# EAGLE design PIC4550 (EAGLE 5.08)
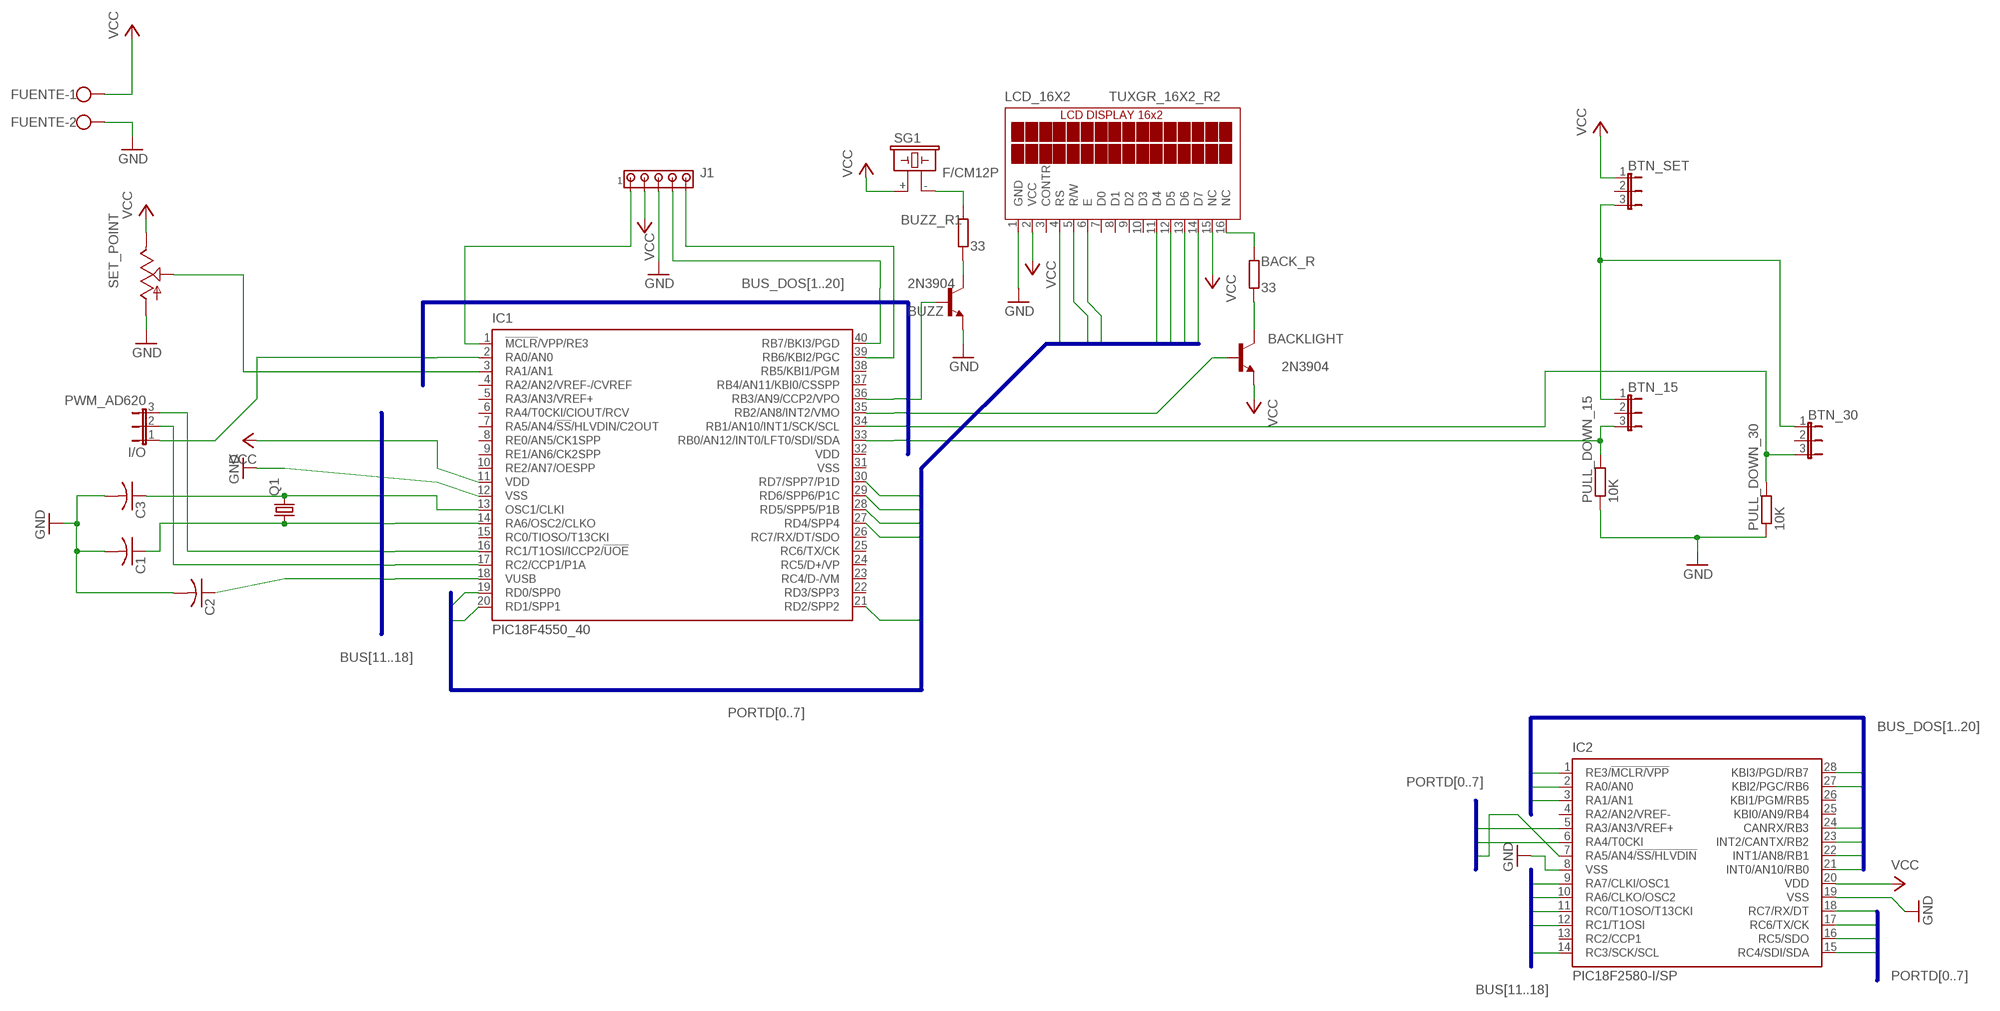
[diagram p0: schematic, sheet 1]

## Parts
BACK_R  33  R-EU_0207/12  [0207/12]
BACKLIGHT  2N3904  [TO92]
BTN_15  JP2E  [JP2]
BTN_30  JP2E  [JP2]
BTN_SET  JP2E  [JP2]
BUZZ  2N3904  [TO92]
BUZZ_R1  33  R-EU_0207/12  [0207/12]
C1  C-US025-024X044  [C025-024X044]
C2  C-US025-024X044  [C025-024X044]
C3  C-US025-024X044  [C025-024X044]
FUENTE  W237-02P  [W237-132]
I/O  PWM_AD620  JP2E  [JP2]
IC1  PIC18F4550_40  [DIL40]
IC2  PIC18F2580-I/SP  [DIL28-3]
J1  MTA05-100  [10X05MTA]
LCD_16X2  TUXGR_16X2_R2  [TUXGR_16X2_R2]
PULL_DOWN_15  10K  R-EU_0207/12  [0207/12]
PULL_DOWN_30  10K  R-EU_0207/12  [0207/12]
Q1  CRYSTALHC49S  [HC49/S]
SET_POINT  TRIM_US-CIP20C-4MM  [CIP20C-4MM]
SG1  F/CM12P  [F/CM12P]

## Nets
BUS13: C3.1 IC1.13(OSC1/CLKI) IC2.9(RA7/CLKI/OSC1) Q1.2
BUS14: C1.1 IC1.14(RA6/OSC2/CLKO) IC2.10(RA6/CLKO/OSC2) Q1.1
BUS15: IC2.11(RC0/T1OSO/T13CKI)
BUS16: I/O.3 IC1.16(RC1/T1OSI/ICCP2/!UOE) IC2.12(RC1/T1OSI)
BUS17: I/O.2 IC1.17(RC2/CCP1/P1A)
BUS18: C2.1 IC1.18(VUSB) IC2.14(RC3/SCK/SCL)
BUS_DOS1: IC1.1(!MCLR!/VPP/RE3) IC2.1(RE3/!MCLR/VPP) J1.1
BUS_DOS2: I/O.1 IC1.2(RA0/AN0) IC2.2(RA0/AN0)
BUS_DOS3: IC1.3(RA1/AN1) IC2.3(RA1/AN1) SET_POINT.S
BUS_DOS13: BTN_15.3 IC1.33(RB0/AN12/INT0/LFT0/SDI/SDA) IC2.21(INT0/AN10/RB0) PULL_DOWN_15.2
BUS_DOS14: BTN_30.3 IC1.34(RB1/AN10/INT1/SCK/SCL) IC2.22(INT1/AN8/RB1) PULL_DOWN_30.2
BUS_DOS15: BACKLIGHT.2(B) IC1.35(RB2/AN8/INT2/VMO) IC2.23(INT2/CANTX/RB2)
BUS_DOS16: BUZZ.2(B) IC1.36(RB3/AN9/CCP2/VPO) IC2.24(CANRX/RB3)
BUS_DOS19: IC1.39(RB6/KBI2/PGC) IC2.27(KBI2/PGC/RB6) J1.5
BUS_DOS20: IC1.40(RB7/BKI3/PGD) IC2.28(KBI3/PGD/RB7) J1.4
GND: BUZZ.3(E) C1.2 C2.2 C3.2 FUENTE.2 IC1.12(VSS) IC2.8(VSS) IC2.19(VSS) J1.3 LCD_16X2.1(GND) PULL_DOWN_15.1 PULL_DOWN_30.1 SET_POINT.A
N$2: BTN_15.1 BTN_30.1 BTN_SET.3
N$15: BACK_R.2 LCD_16X2.16(NC)
N$16: BACK_R.1 BACKLIGHT.1(C)
N$17: BUZZ_R1.2 SG1.-
N$18: BUZZ.1(C) BUZZ_R1.1
PORTD0: IC1.19(RD0/SPP0) IC2.5(RA3/AN3/VREF+) LCD_16X2.4(RS)
PORTD1: IC1.20(RD1/SPP1) IC2.6(RA4/T0CKI) LCD_16X2.5(R/W)
PORTD2: IC1.21(RD2/SPP2) IC2.7(RA5/AN4/!SS/HLVDIN) LCD_16X2.6(E)
PORTD4: IC1.27(RD4/SPP4) IC2.15(RC4/SDI/SDA) LCD_16X2.11(D4)
PORTD5: IC1.28(RD5/SPP5/P1B) IC2.16(RC5/SDO) LCD_16X2.12(D5)
PORTD6: IC1.29(RD6/SPP6/P1C) IC2.17(RC6/TX/CK) LCD_16X2.13(D6)
PORTD7: IC1.30(RD7/SPP7/P1D) IC2.18(RC7/RX/DT) LCD_16X2.14(D7)
VCC: BACKLIGHT.3(E) BTN_SET.1 FUENTE.1 IC1.11(VDD) IC2.20(VDD) J1.2 LCD_16X2.2(VCC) LCD_16X2.15(NC) SET_POINT.E SG1.+
Unconnected: BTN_15.2 BTN_30.2 BTN_SET.2 IC1.4(RA2/AN2/VREF-/CVREF) IC1.5(RA3/AN3/VREF+) IC1.6(RA4/T0CKI/CIOUT/RCV) IC1.7(RA5/AN4/!SS!/HLVDIN/C2OUT) IC1.8(RE0/AN5/CK1SPP) IC1.9(RE1/AN6/CK2SPP) IC1.10(RE2/AN7/OESPP) IC1.15(RC0/TIOSO/T13CKI) IC1.22(RD3/SPP3) IC1.23(RC4/D-/VM) IC1.24(RC5/D+/VP) IC1.25(RC6/TX/CK) IC1.26(RC7/RX/DT/SDO) IC1.37(RB4/AN11/KBI0/CSSPP) IC1.38(RB5/KBI1/PGM) IC2.4(RA2/AN2/VREF-) IC2.13(RC2/CCP1) IC2.25(KBI0/AN9/RB4) IC2.26(KBI1/PGM/RB5) LCD_16X2.3(CONTR) LCD_16X2.7(D0) LCD_16X2.8(D1) LCD_16X2.9(D2) LCD_16X2.10(D3)

## Buses
PORTD[0..7]
BUS[11..18]
BUS_DOS[1..20]

## Power pins joined to a net without a drawn wire
VDD: IC1.32(VDD)
VSS: IC1.31(VSS)

## Library data of the parts
BACK_R BUZZ_R1 PULL_DOWN_15 PULL_DOWN_30 = rcl:R-EU_: RESISTOR, European symbol
BACKLIGHT BUZZ = transistor-neu-to92:2N3904: NPN TRANSISTOR
BTN_15 BTN_30 BTN_SET I/O = jumper:JP2E: JUMPER
C1-C3 = rcl:C-US: CAPACITOR, American symbol
FUENTE = con-wago-508:W237-02P: WAGO SREW CLAMP
IC1 = microchip:PIC18F4*_40: USB Microcontrollers with nanoWatt Technology High-Performance, Enhanced Flash, 28/40/44-Pin, Source: http://ww1.microchip.com/downloads/en/devicedoc/39632c.pdf
IC2 = microchip:PIC18F2*80: 28-Pin Enhanced Flash Microcontrollers with ECAN(TM) Technology 10-Bit A/D and nanoWatt Technology Source: http://www.microchip.com .. 39637a.pdf
J1 = con-amp:MTA05-100: AMP connector
LCD_16X2 = display-lcd:TUXGR_16X2_R2: Tuxgraphics LCD display 16x2 characters reflective, without background light Source: tuxgr_12x2_r2.pdf
Q1 = crystal:CRYSTAL: CRYSTAL
SET_POINT = pot:TRIM_US-: POTENTIOMETER
SG1 = buzzer:F/CM12P: BUZZER Source: Buerklin

## Board
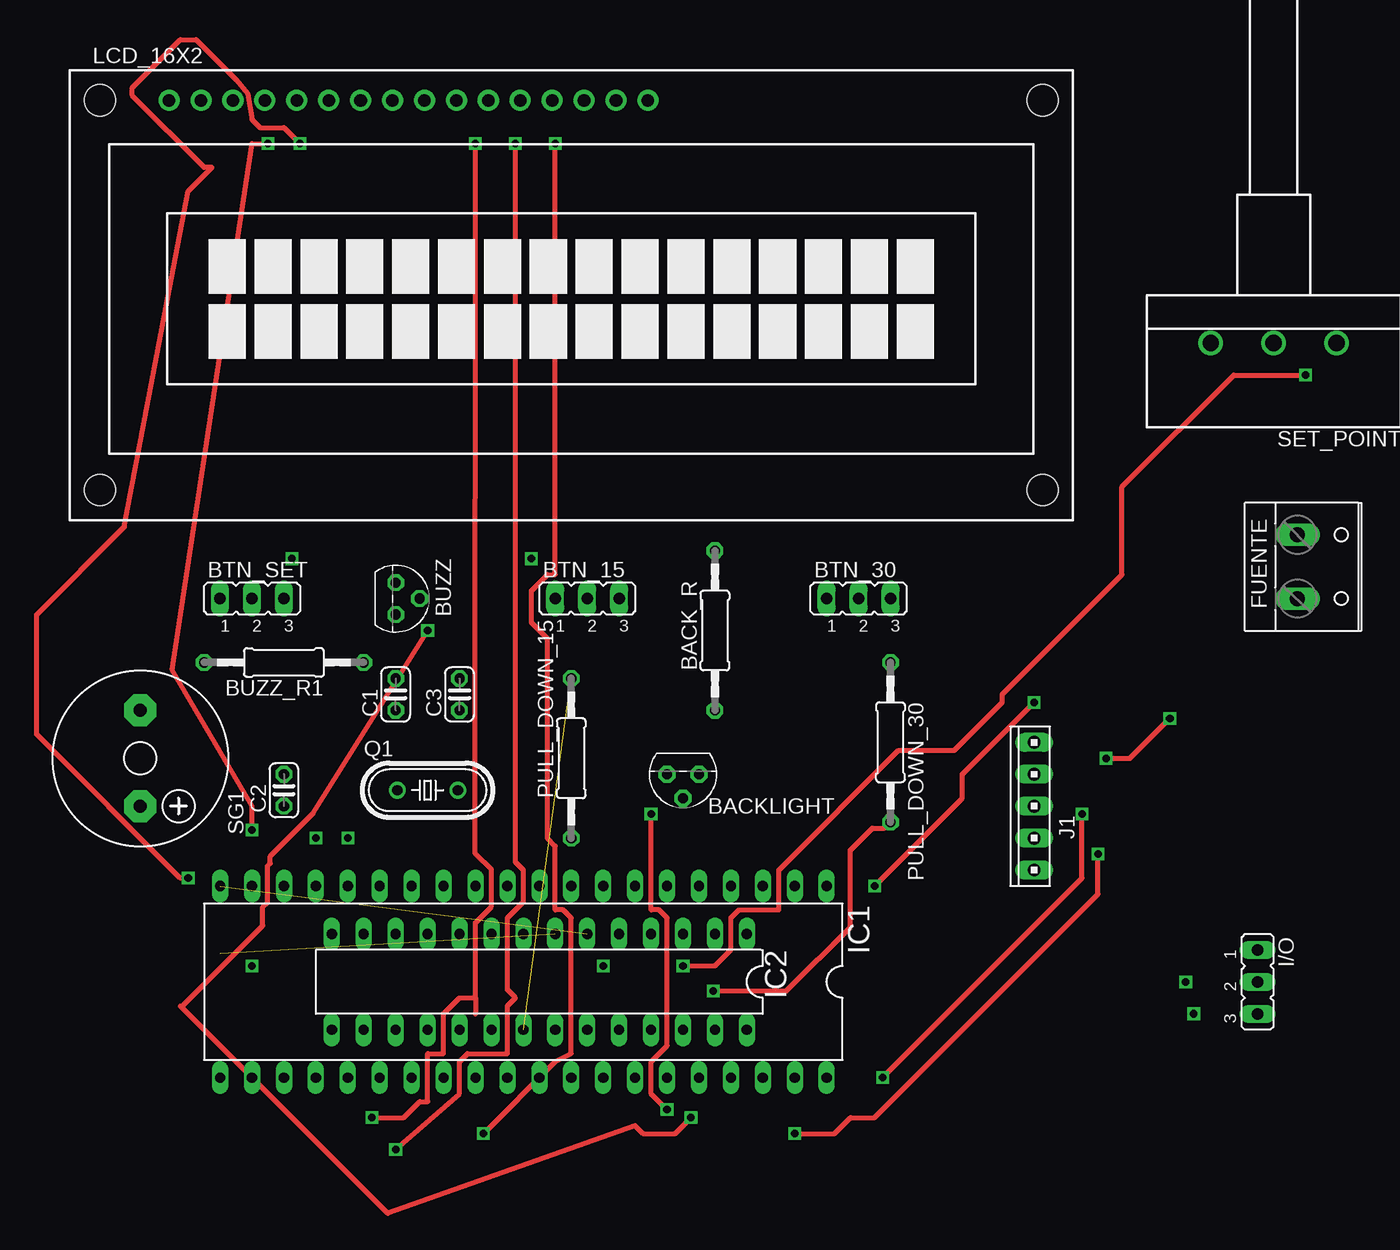
[diagram p1: board, top side]
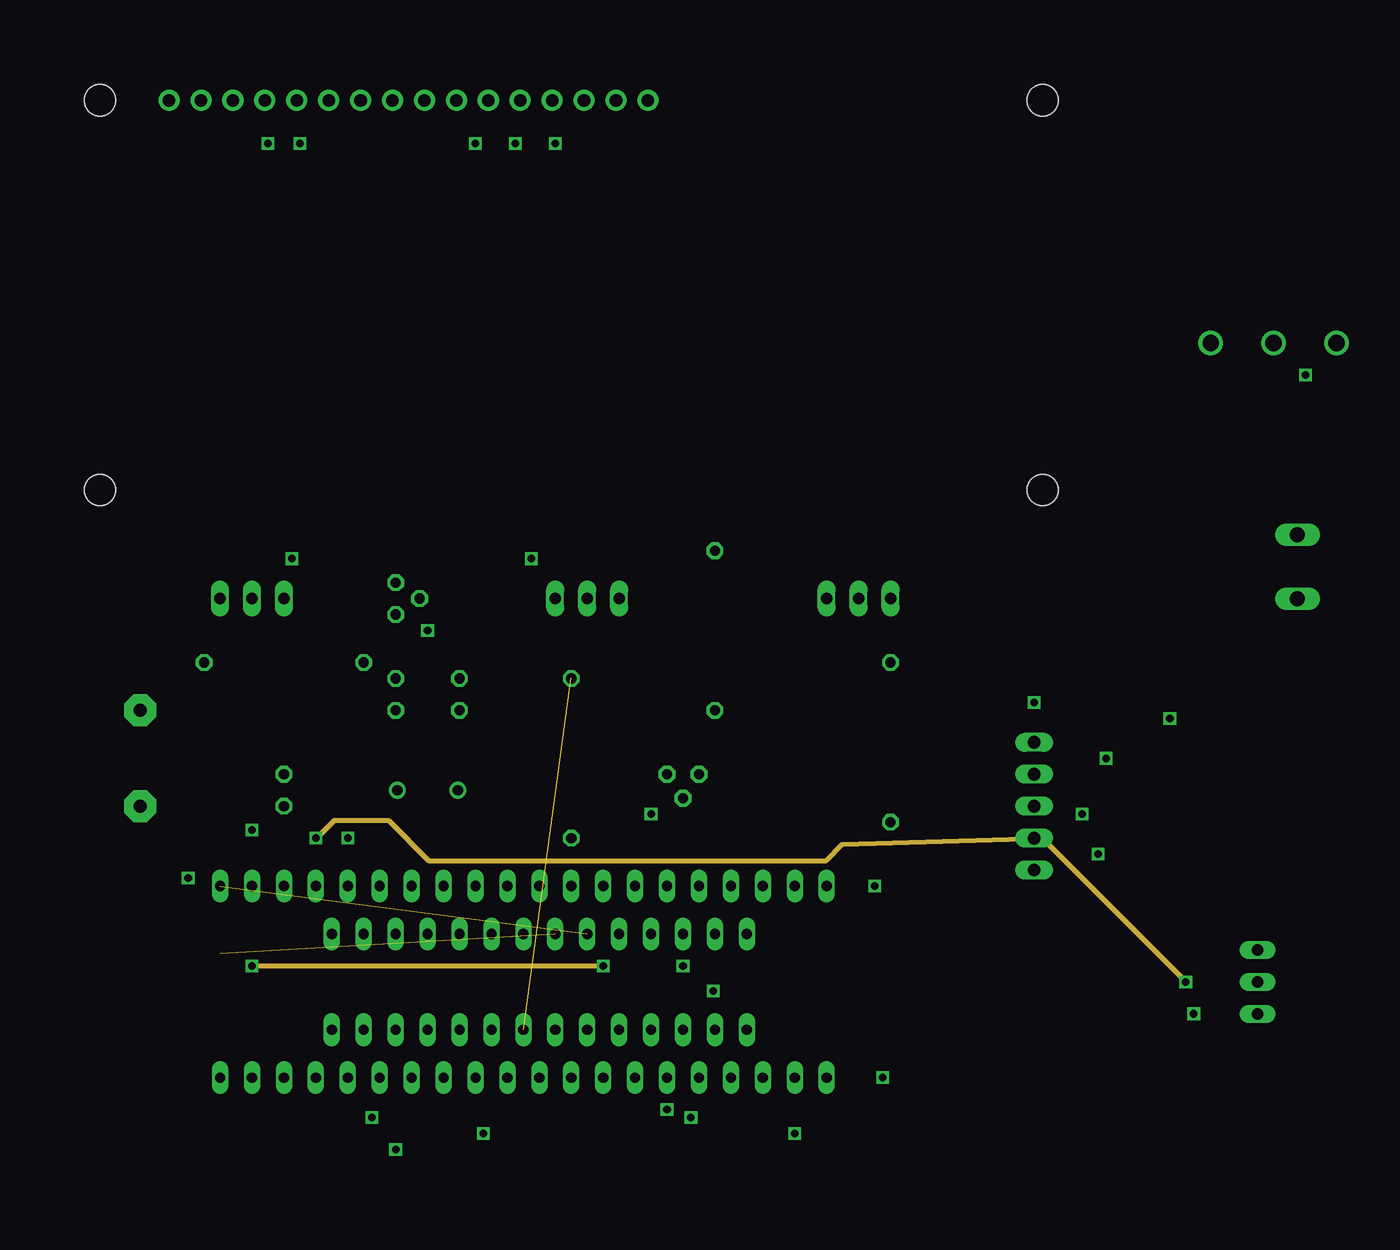
[diagram p2: board, inner layer Route14]
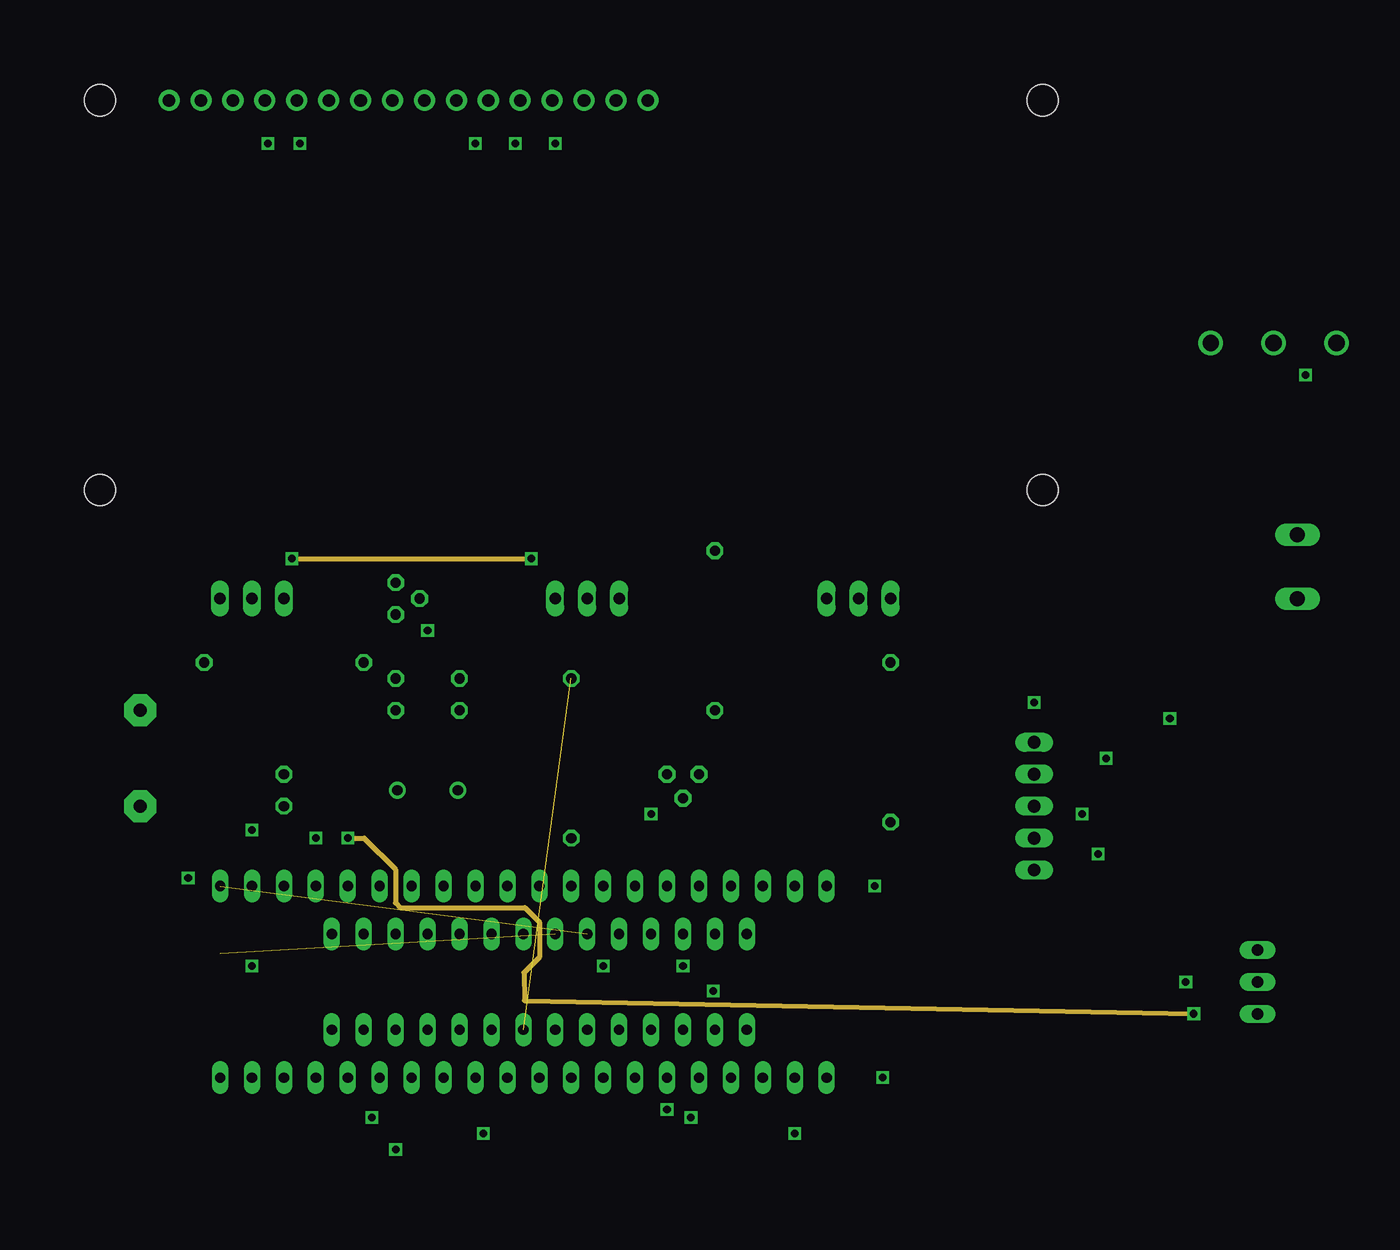
[diagram p3: board, inner layer Route15]
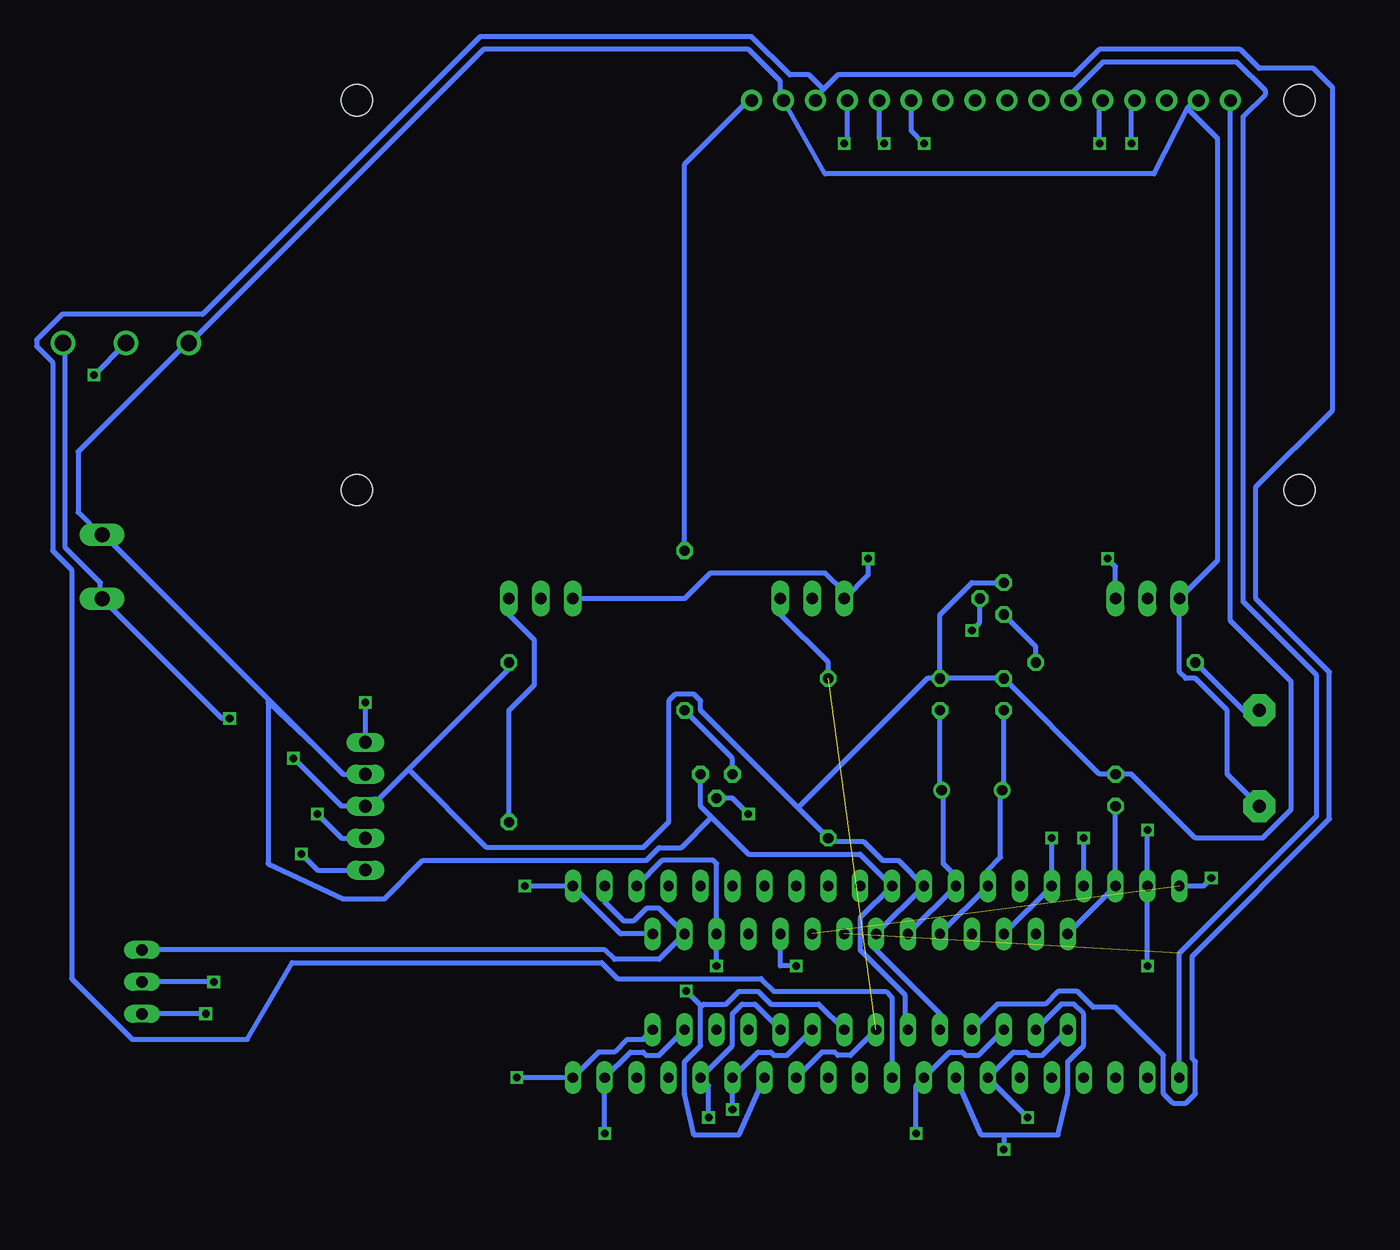
[diagram p4: board, bottom side, seen from below]

No outline drawn. Coordinates in mm, seen from the top.
Copper layers (1*14*15*16): Top 0.035mm / dielectric 1.5mm / Route14 0.035mm / dielectric 0.15mm / Route15 0.035mm / dielectric 0.2mm / Bottom 0.035mm
Design rules "default *": minimum track width 16mil, minimum drill 24mil, track to track 16mil, track to pad 16mil, pad to pad 16mil, via to via 16mil, smd to smd 8mil, copper to edge 40mil, drill to drill 8mil, minimum pad ring 10mil, minimum via ring 8mil, stop-mask expansion 4mil, vias tented up to drill 0mil, thermal gap 10mil

### Footprints (pad centres in the part's own frame; a part is rotated, then mirrored left to right if it is on the bottom)
0207/12 = drill 0.813 octagon: 1 -6.35,0; 2 6.35,0
TO92 = drill 0.813 octagon: 1 1.27,0; 2 0,1.905; 3 -1.27,0
JP2 = drill 0.914 long: 1 -2.54,0; 2 0,0; 3 2.54,0
C025-024X044 = drill 0.813 octagon: 1 -1.27,0; 2 1.27,0
W237-132 = drill 1.194 long: 1 -2.54,-0.635; 2 2.54,-0.635
DIL40 = drill 0.813 long: 1 -24.13,-7.62; 2 -21.59,-7.62; 3 -19.05,-7.62; 4 -16.51,-7.62; 5 -13.97,-7.62; 6 -11.43,-7.62; 7 -8.89,-7.62; 8 -6.35,-7.62; 9 -3.81,-7.62; 10 -1.27,-7.62; 11 1.27,-7.62; 12 3.81,-7.62; 13 6.35,-7.62; 14 8.89,-7.62; 15 11.43,-7.62; 16 13.97,-7.62; 17 16.51,-7.62; 18 19.05,-7.62; 19 21.59,-7.62; 20 24.13,-7.62; 21 24.13,7.62; 22 21.59,7.62; 23 19.05,7.62; 24 16.51,7.62; 25 13.97,7.62; 26 11.43,7.62; 27 8.89,7.62; 28 6.35,7.62; 29 3.81,7.62; 30 1.27,7.62; 31 -1.27,7.62; 32 -3.81,7.62; 33 -6.35,7.62; 34 -8.89,7.62; 35 -11.43,7.62; 36 -13.97,7.62; 37 -16.51,7.62; 38 -19.05,7.62; 39 -21.59,7.62; 40 -24.13,7.62
DIL28-3 = drill 0.813 long: 1 -16.51,-3.81; 2 -13.97,-3.81; 3 -11.43,-3.81; 4 -8.89,-3.81; 5 -6.35,-3.81; 6 -3.81,-3.81; 7 -1.27,-3.81; 8 1.27,-3.81; 9 3.81,-3.81; 10 6.35,-3.81; 11 8.89,-3.81; 12 11.43,-3.81; 13 13.97,-3.81; 14 16.51,-3.81; 15 16.51,3.81; 16 13.97,3.81; 17 11.43,3.81; 18 8.89,3.81; 19 6.35,3.81; 20 3.81,3.81; 21 1.27,3.81; 22 -1.27,3.81; 23 -3.81,3.81; 24 -6.35,3.81; 25 -8.89,3.81; 26 -11.43,3.81; 27 -13.97,3.81; 28 -16.51,3.81
10X05MTA = drill 1.016 long: 1 5.08,0; 2 2.54,0; 3 0,0; 4 -2.54,0; 5 -5.08,0
TUXGR_16X2_R2 = drill 1 pad 1.676 round: 1 -32,15.5; 2 -29.46,15.5; 3 -26.92,15.5; 4 -24.38,15.5; 5 -21.84,15.5; 6 -19.3,15.5; 7 -16.76,15.5; 8 -14.22,15.5; 9 -11.68,15.5; 10 -9.14,15.5; 11 -6.6,15.5; 12 -4.06,15.5; 13 -1.52,15.5; 14 1.02,15.5; 15 3.56,15.5; 16 6.1,15.5 | hole 2.5: -37.5,-15.5; 37.5,-15.5; -37.5,15.5; 37.5,15.5
HC49/S = drill 0.813 round: 1 -2.413,0; 2 2.413,0
CIP20C-4MM = drill 1.3 pad 1.93 round: A -5,0; E 5,0; S 0,0
F/CM12P = drill 1.016 pad 2.54 octagon: + 3.81,0; - -3.81,0

### Placement (x,y rotation side)
BACK_R  88.9,72.39 90 top
BACKLIGHT  86.36,60.96 180 top
BTN_15  78.74,74.93 0 top
BTN_30  100.33,74.93 0 top
BTN_SET  52.07,74.93 0 top
BUZZ  63.5,74.93 270 top
BUZZ_R1  54.61,69.85 180 top
C1  63.5,67.31 90 top
C2  54.61,59.69 90 top
C3  68.58,67.31 90 top
FUENTE  135.89,77.47 270 top
I/O  132.08,44.45 270 top
IC1  73.66,44.45 180 top
IC2  74.93,44.45 180 top
J1  114.3,58.42 90 top
LCD_16X2  77.47,99.06 0 top
PULL_DOWN_15  77.47,62.23 90 top
PULL_DOWN_30  102.87,63.5 270 top
Q1  66.04,59.69 0 top
SET_POINT  133.35,95.25 180 top
SG1  43.18,62.23 270 top

### Tracks (layer width: path | path; a pad name or v marks a point on that pad's centre or on a via)
BUS13
  Bottom 0.406: C3.1 68.58,59.69 Q1.2 68.33,59.69 68.33,53.85 67.56,53.09 67.56,52.07 IC1.13 IC2.9
BUS14
  Bottom 0.406: IC2.10 IC1.14 64.77,53.34 63.75,54.36 63.75,59.69 Q1.1 63.5,59.69 C1.1
BUS16  (via drill 0.6)
  Route15 0.406: v127,41.91 73.75,42.95 73.7,45.17 74.93,46.41 74.93,49.2 73.78,50.36 63.85,50.36 63.48,50.72 63.48,53.39 60.99,55.88 v59.69,55.88
  Bottom 0.406: IC2.12 IC1.16 v59.69,55.88 | v127,41.91 I/O.3
BUS17  (via drill 0.6)
  Route14 0.406: v57.15,55.88 57.22,55.88 58.63,57.29 62.93,57.29 66.13,54.09 97.76,54.09 99.05,55.38 114.94,55.88 v126.36,44.45
  Bottom 0.406: IC1.17 v57.15,55.88 | v126.36,44.45 I/O.2
BUS18
  Bottom 0.406: C2.1 IC1.18 IC2.14
BUS_DOS1  (via drill 0.6)
  Top 0.406: v114.3,66.67 108.58,60.96 108.58,59.05 v101.6,52.07
  Bottom 0.406: IC2.1 93.98,48.26 IC1.1 v101.6,52.07 | v114.3,66.67 J1.1
BUS_DOS2
  Bottom 0.406: IC1.2 95.25,50.8 93.73,49.28 92.96,49.28 91.95,50.29 90.93,50.29 IC2.2 90.93,46.23 94.49,46.23 95.25,46.99 I/O.1
BUS_DOS3  (via drill 0.6)
  Top 0.406: v135.89,92.71 130.18,92.71 121.28,83.82 121.28,76.83 111.76,67.31 111.76,66.67 107.95,62.87 103.5,62.87 93.98,53.34 93.98,50.16 90.81,50.16 90.17,49.53 90.17,46.99 88.9,45.72 v86.36,45.72
  Bottom 0.406: IC1.3 90.68,54.1 86.61,54.1 86.36,53.85 IC2.3 v86.36,45.72 | v135.89,92.71 SET_POINT.S
BUS_DOS13  (1 unrouted)
  Bottom 0.406: IC2.21 75.69,38.61 76.71,38.61 76.96,38.86 77.98,38.86 IC1.33 | PULL_DOWN_15.2 77.47,69.85 81.28,73.66 BTN_15.3
BUS_DOS14  (via drill 0.6)
  Top 0.406: v88.77,43.72 94.61,43.72 99.68,48.79 99.68,54.93 101.43,56.68 102.4,56.68 PULL_DOWN_30.2
  Bottom 0.406: IC1.34 84.58,32.26 88.14,32.26 88.9,35.56 88.9,38.1 87.63,39.37 87.63,42.42 | 87.63,42.42 87.38,42.67 85.6,42.67 84.58,43.69 83.06,43.69 82.04,42.67 78.23,42.67 IC2.22 | PULL_DOWN_30.2 102.87,66.04 100.84,68.07 100.84,71.63 102.87,73.66 BTN_30.3 | 87.63,42.42 87.63,42.58 v88.77,43.72
BUS_DOS15  (via drill 0.6)
  Top 0.406: v83.82,57.78 83.82,50.16 84.45,50.16 85.09,49.53 85.09,39.37 83.82,38.1 83.82,35.56 v85.09,34.29
  Bottom 0.406: IC2.23 80.77,38.61 81.79,38.61 82.04,38.86 83.06,38.86 IC1.35 v85.09,34.29 | BACKLIGHT.2 85.09,59.05 v83.82,57.78
BUS_DOS16  (via drill 0.6)
  Top 0.406: v66.04,72.39 56.9,57.81 53.53,54.43 53.53,53.88 53.31,53.66 53.31,50.79 52.93,50.42 52.93,48.92 46.56,42.55 46.35,42.55 62.87,26.04 82.55,33.02 83.19,32.38 85.72,32.38 v87,33.66
  Bottom 0.406: IC2.24 83.31,42.67 84.33,42.67 85.09,41.91 85.09,39.37 IC1.36 87,36.2 v87,33.66 | BUZZ.2 65.41,73.03 v66.04,72.39
BUS_DOS19  (via drill 0.6)
  Top 0.406: v119.38,54.61 119.38,51.44 101.6,33.66 99.69,33.66 98.42,32.38 v95.25,32.38
  Bottom 0.406: IC2.27 90.93,38.61 91.95,38.61 92.2,38.86 93.22,38.86 IC1.39 v95.25,32.38 | J1.5 118.11,53.34 v119.38,54.61
BUS_DOS20  (via drill 0.6)
  Top 0.406: v118.11,57.78 118.11,52.7 v102.23,36.83
  Bottom 0.406: IC2.28 92.2,39.88 93.47,39.88 94.49,38.86 95.76,38.86 IC1.40 v102.23,36.83 | J1.4 116.2,55.88 v118.11,57.78
GND  (via drill 0.6)
  Top 0.406: v120.02,62.23 121.92,62.23 v125.09,65.41
  Bottom 0.406: PULL_DOWN_30.1 102.87,69.34 110.87,61.34 | 110.87,61.34 113.79,58.42 J1.3 116.2,58.42 v120.02,62.23 | IC2.19 68.58,41.91 73.91,47.24 73.91,48.01 IC2.8 IC1.12 71.88,54.1 73.15,54.1 74.68,55.63 77.22,55.63 PULL_DOWN_15.1 79.88,58.29 | 79.88,58.29 87.63,66.04 87.63,66.8 88.14,67.31 89.66,67.31 90.17,66.8 90.17,57.15 92.2,55.12 104.65,55.12 110.87,61.34 | C3.2 69.6,68.58 79.88,58.29 | BUZZ.3 66.04,76.2 68.58,73.66 C3.2 | C3.2 C1.2 55.88,60.96 C2.2 53.34,60.96 48.26,55.88 42.93,55.88 40.64,58.17 40.64,68.33 45.47,73.15 LCD_16X2.1 | SET_POINT.A 138.18,95.25 138.18,78.99 135.38,76.2 135.38,74.93 FUENTE.2 125.73,65.41 v125.09,65.41
N$2  (via drill 0.6)
  Route15 0.406: v55.24,78.11 v74.3,78.11
  Bottom 0.406: BTN_30.1 88.9,74.93 86.87,76.96 77.72,76.96 76.2,75.44 BTN_15.1 74.3,76.83 v74.3,78.11 | BTN_SET.3 54.61,77.47 v55.24,78.11
N$15
  Bottom 0.406: BACK_R.2 88.9,109.47 83.82,114.55 LCD_16X2.16
N$16
  Bottom 0.406: BACKLIGHT.1 85.09,62.23 BACK_R.1
N$17
  Bottom 0.406: SG1.- 44.45,66.04 BUZZ_R1.2
N$18
  Bottom 0.406: BUZZ_R1.1 60.96,71.12 BUZZ.1
PORTD0  (via drill 0.6)
  Top 0.406: v53.34,111.12 52.07,111.12 45.72,69.22 52.07,58.42 v52.07,56.52
  Route14 0.406: v52.07,45.72 v80.01,45.72
  Bottom 0.406: LCD_16X2.4 53.34,114.56 v53.34,111.12 | v52.07,56.52 IC1.19 v52.07,45.72 | v80.01,45.72 81.28,45.72 IC2.5
PORTD1  (via drill 0.6)  (1 unrouted)
  Top 0.406: v46.99,52.7 46.35,52.7 34.92,64.14 34.92,73.66 41.91,80.64 46.99,107.31 48.9,109.22 48.26,109.22 42.55,114.94 42.55,115.57 46.35,119.38 47.62,119.38 50.8,116.2 51.74,115.08 52.07,113.03 52.7,112.39 54.61,112.39 v55.88,111.12
  Bottom 0.406: IC1.20 47.62,52.07 v46.99,52.7 | v55.88,111.12 55.88,114.31 LCD_16X2.5
PORTD2  (1 unrouted)
  Bottom 0.406: IC1.21 49.53,46.74 38.61,57.66 38.61,68.83 44.45,74.68 44.45,113.28 42.67,115.06 42.67,115.32 44.96,117.6 55.63,117.6 58.42,114.81 LCD_16X2.6
PORTD4  (via drill 0.6)
  Top 0.406: 69.85,43.18 69.85,49.16 71.12,50.43 71.12,53.37 69.83,54.66 v69.85,111.12 | v61.59,33.66 64.14,33.66 65.41,34.92 66.04,34.92 66.04,38.73 67.31,38.73 67.31,41.91 68.58,43.18 69.85,43.18 | 69.85,43.18 69.85,41.91
  Bottom 0.406: IC2.15 60.45,38.61 61.47,38.61 61.72,38.86 62.74,38.86 IC1.27 v61.59,33.66 | LCD_16X2.11 70.87,112.14 v69.85,111.12
PORTD5  (via drill 0.6)
  Top 0.406: v73.03,111.12 73.03,53.98 73.66,53.34 73.66,50.8 72.39,49.53 72.39,43.81 73.03,43.18 72.39,42.55 72.39,38.73 69.22,38.73 68.58,38.1 68.58,35.56 v63.5,31.11
  Bottom 0.406: IC1.28 65.28,32.26 63.5,32.26 | 63.5,32.26 59.18,32.26 58.42,35.56 58.42,38.1 57.15,39.37 57.15,41.91 57.91,42.67 58.93,42.67 IC2.16 | LCD_16X2.12 73.41,111.51 v73.03,111.12 | 63.5,32.26 v63.5,31.11
PORTD6  (via drill 0.6)
  Top 0.406: v76.2,111.12 76.2,76.83 75.56,76.83 74.3,75.56 74.3,73.03 75.56,71.75 75.56,55.88 76.2,55.24 76.2,50.16 76.83,50.16 77.47,49.53 77.47,38.73 76.2,38.1 v70.48,32.38
  Bottom 0.406: IC2.17 65.53,38.61 66.55,38.61 66.8,38.86 67.82,38.86 IC1.29 70.48,36.2 v70.48,32.38 | LCD_16X2.13 75.95,111.38 v76.2,111.12
PORTD7
  Bottom 0.406: 77.85,115.44 76.71,116.59 57.91,116.59 55.88,118.62 44.7,118.62 43.18,117.09 38.86,117.09 37.34,115.57 37.34,89.92 43.43,83.82 43.43,74.93 37.59,69.09 37.59,57.4 48.51,46.48 48.51,38.35 48.26,38.1 48.26,35.56 49.02,34.8 50.04,34.8 50.8,35.56 50.8,38.61 54.61,42.42 56.39,42.42 57.66,43.69 59.18,43.69 60.2,42.67 64.01,42.67 IC2.18 | 77.85,115.44 78.49,114.81 LCD_16X2.14 | IC1.30 72.39,43.18 72.9,43.69 81.79,43.69 82.8,44.7 94.23,44.7 95.5,45.97 120.14,45.97 123.7,39.88 132.84,39.88 137.67,44.7 137.67,77.22 139.19,78.74 139.19,93.73 140.46,95 140.46,95.5 138.43,97.54 127.25,97.54 105.16,119.63 83.57,119.63 80.52,116.59 78.99,116.59 77.85,115.44
VCC
  Bottom 0.406: SG1.+ 45.72,60.96 45.72,66.04 48.26,68.58 49.02,68.58 49.53,69.09 BTN_SET.1 46.48,77.98 46.48,111.51 48.9,113.92 | 48.9,113.92 51.56,108.71 77.72,108.71 LCD_16X2.15 81.28,114.81 81.28,116.08 83.82,118.62 104.9,118.62 128.27,95.25 SET_POINT.E 128.52,95.25 137.16,86.61 137.16,81.79 135.38,80.01 FUENTE.1 135.13,80.01 117.47,62.36 | 48.9,113.92 48.26,114.55 LCD_16X2.2 | IC2.20 71.37,40.89 71.37,43.43 74.93,46.99 74.93,49.53 IC1.11 74.93,54.61 83.82,54.61 86.74,57.53 | BACKLIGHT.3 87.63,58.42 86.74,57.53 | J1.2 116.08,60.96 117.47,62.36 | 86.74,57.53 89.15,55.12 90.93,55.12 91.95,54.1 109.73,54.1 112.78,51.05 116.08,51.05 122.05,53.85 122.05,66.67 117.47,62.36